# EAGLE schematic leto_ppm (EAGLE 9.1.2)

## Sheet 1 of 2
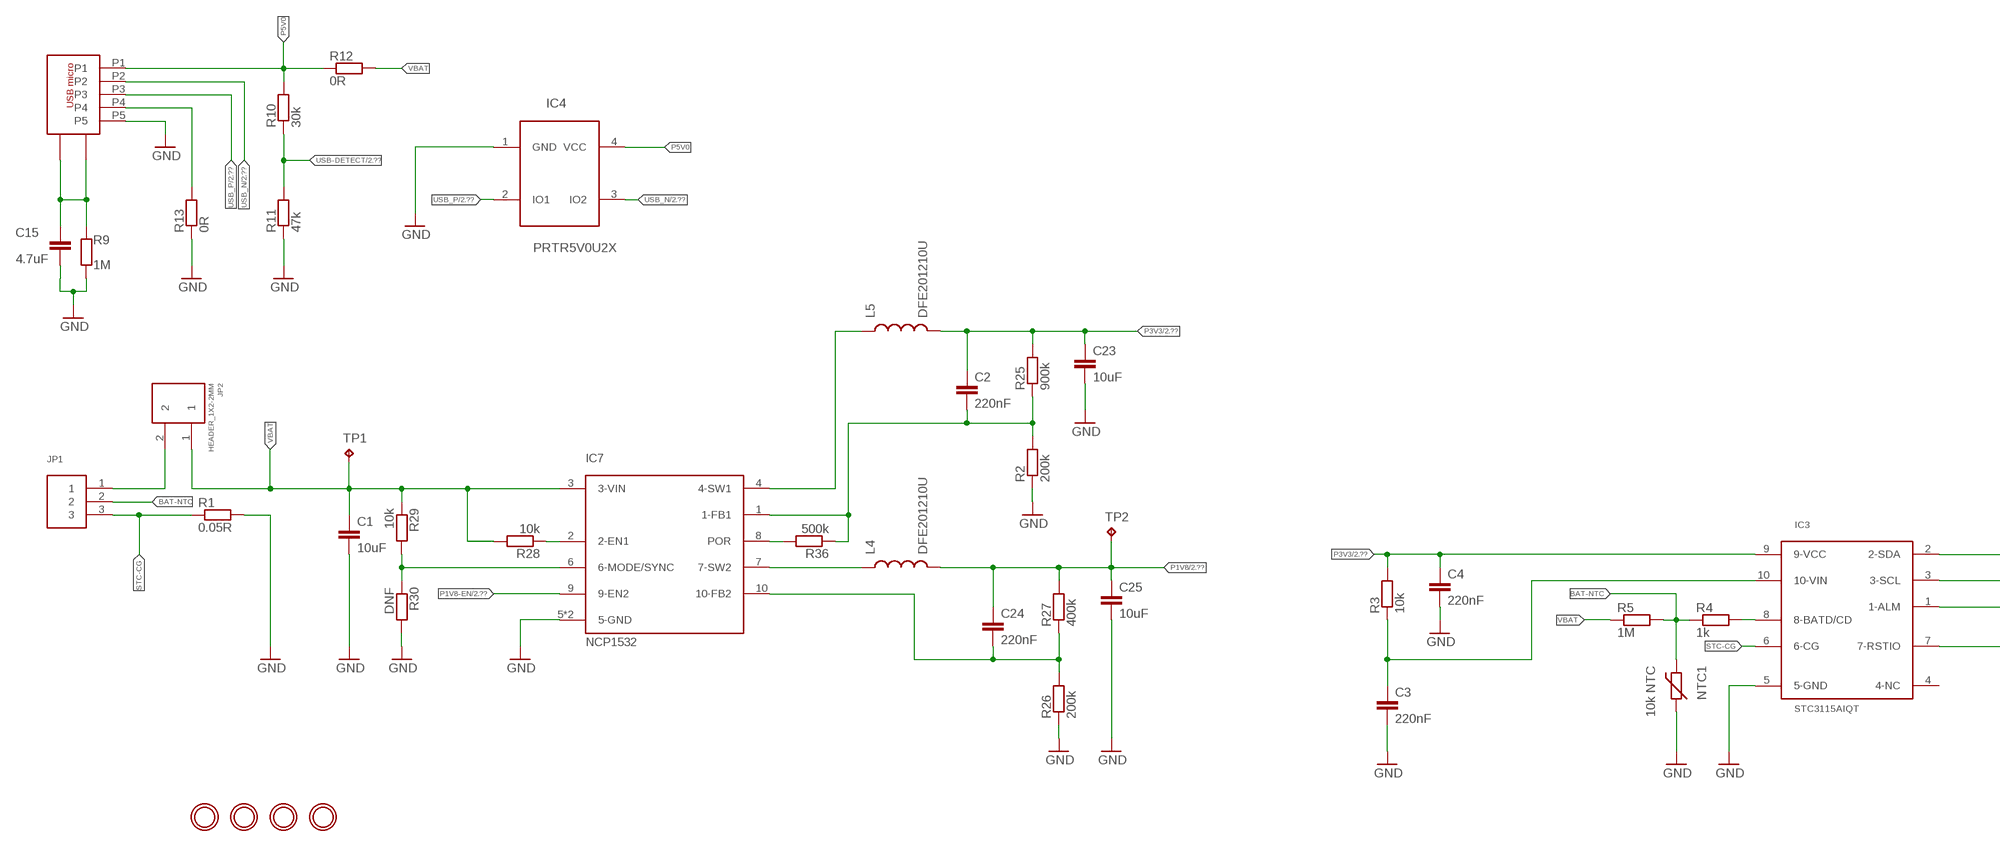
[diagram p0: schematic, sheet 1, part 1 of 2]
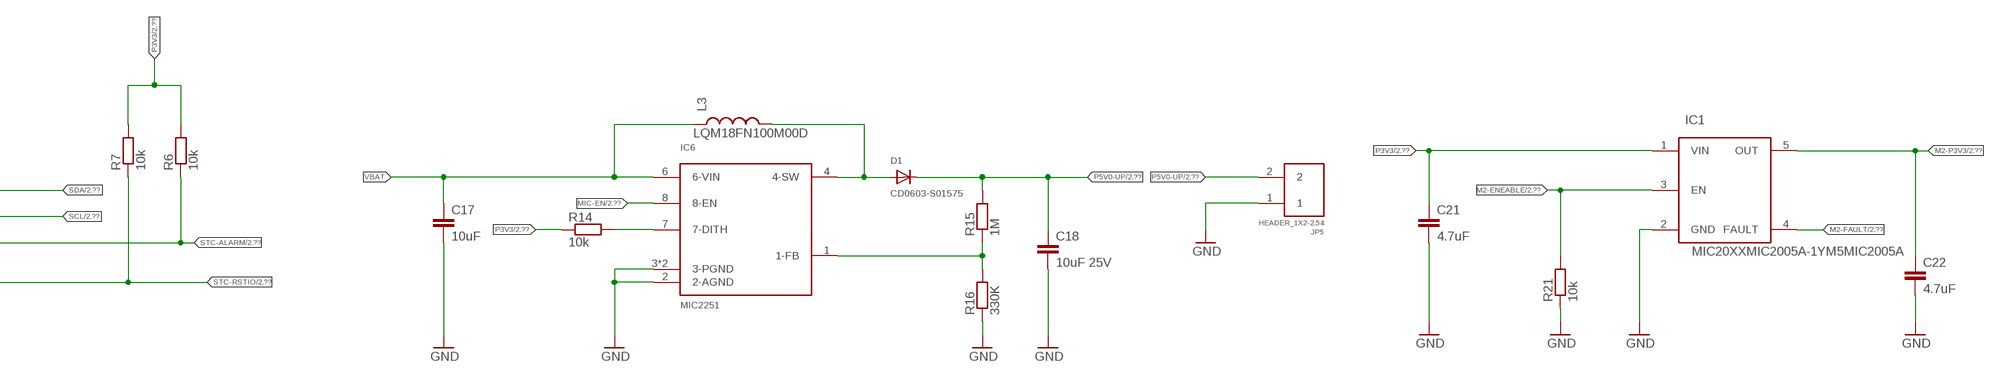
[diagram p1: schematic, sheet 1, part 2 of 2]

### Parts
C1  10uF  C-EUC0603  [C0603]
C2  220nF  C-EUC0402-SMALL  [C0402-SMALL]
C3  220nF  C-EUC0402-SMALL  [C0402-SMALL]
C4  220nF  C-EUC0402-SMALL  [C0402-SMALL]
C15  4.7uF  C-EUC0402-SMALL  [C0402-SMALL]
C17  10uF  C-EUC0603  [C0603]
C18  10uF 25V  C-EUC0603  [C0603]
C21  4.7uF  C-EUC0402-SMALL  [C0402-SMALL]
C22  4.7uF  C-EUC0402-SMALL  [C0402-SMALL]
C23  10uF  C-EUC0603  [C0603]
C24  220nF  C-EUC0402-SMALL  [C0402-SMALL]
C25  10uF  C-EUC0603  [C0603]
D1  CD0603-S01575  DIODE  [0603-DIODE]
IC1  MIC20XXMIC2005A-1YM5MIC2005A  [SOT23-5]
IC3  STC3115AIQT  [DFN10_2X3MM]
IC4  PRTR5V0U2X  [SOT143]
IC6  MIC2251  [MLF-8-2X2]
IC7  NCP1532  [UDNF10-3X3]
JP1  HEADER_1X32.54MM  [1X3-2.54MM]
JP2  HEADER_1X2-2MM  [1X2_2MM]
JP5  HEADER_1X2-2.54  [1X2-2.54MM]
L3  LQM18FN100M00D  INDUCTOR0603  [0603]
L4  DFE201210U  INDUCTOR0805  [0805]
L5  DFE201210U  INDUCTOR0805  [0805]
MD1  MOUNTINGHOLE2.5  [MOUNTINGHOLE_2.5_PLATED]
MD2  MOUNTINGHOLE2.5  [MOUNTINGHOLE_2.5_PLATED]
MD3  MOUNTINGHOLE2.5  [MOUNTINGHOLE_2.5_PLATED]
MD4  MOUNTINGHOLE2.5  [MOUNTINGHOLE_2.5_PLATED]
NTC1  10k NTC  RESISTOR-NTC0402  [C0402-SMALL]
R1  0.05R  RESISTOR0603-RES  [0603-RES]
R2  200k  RESISTORC0402-SMALL  [C0402-SMALL]
R3  10k  RESISTORC0402-SMALL  [C0402-SMALL]
R4  1k  RESISTORC0402-SMALL  [C0402-SMALL]
R5  1M  RESISTORC0402-SMALL  [C0402-SMALL]
R6  10k  RESISTORC0402-SMALL  [C0402-SMALL]
R7  10k  RESISTORC0402-SMALL  [C0402-SMALL]
R9  1M  RESISTORC0402-SMALL  [C0402-SMALL]
R10  30k  RESISTORC0402-SMALL  [C0402-SMALL]
R11  47k  RESISTORC0402-SMALL  [C0402-SMALL]
R12  0R  RESISTORC0402-SMALL  [C0402-SMALL]
R13  0R  RESISTORC0402-SMALL  [C0402-SMALL]
R14  10k  RESISTORC0402-SMALL  [C0402-SMALL]
R15  1M  RESISTORC0402-SMALL  [C0402-SMALL]
R16  330K  RESISTORC0402-SMALL  [C0402-SMALL]
R21  10k  RESISTORC0402-SMALL  [C0402-SMALL]
R25  900k  RESISTORC0402-SMALL  [C0402-SMALL]
R26  200k  RESISTORC0402-SMALL  [C0402-SMALL]
R27  400k  RESISTORC0402-SMALL  [C0402-SMALL]
R28  10k  RESISTORC0402-SMALL  [C0402-SMALL]
R29  10k  RESISTORC0402-SMALL  [C0402-SMALL]
R30  DNF  RESISTORC0402-SMALL  [C0402-SMALL]
R36  500k  RESISTORC0402-SMALL  [C0402-SMALL]
TP1  TPTP20R  [TP20R]
TP2  TPTP11R  [TP11R]
USB1  USB3140-30  [USB3140-30-0230]

### Nets
BAT-NTC: JP1.2 NTC1.1 R4.1 R5.2
GND: C1.2 C3.2 C4.2 C15.2 C17.2 C18.2 C21.2 C22.2 C23.2 C25.2 IC1.2(GND) IC3.5(5-GND) IC4.1(GND) IC6.2(2-AGND) IC6.3(3-PGND) IC6.EP(3-PGND) IC7.5(5-GND) IC7.P$11(5-GND) JP5.1 NTC1.2 R1.2 R2.1 R9.1 R11.1 R13.1 R16.1 R21.1 R26.1 R30.2 USB1.P5 ; also sheet 2
M2-ENEABLE: IC1.3(EN) R21.2 ; also sheet 2
M2-FAULT: IC1.4(FAULT) ; also sheet 2
M2-P3V3: C22.1 IC1.5(OUT) ; also sheet 2
MIC-EN: IC6.8(8-EN) ; also sheet 2
N$1: JP1.1 JP2.2
N$3: IC7.4(4-SW1) L5.1
N$4: C3.1 IC3.10(10-VIN) R3.1
N$5: IC3.8(8-BATD/CD) R4.2
N$11: IC7.8(POR) R36.2
N$12: R13.2 USB1.P4
N$13: IC6.7(7-DITH) R14.2
N$14: C2.2 IC7.1(1-FB1) R2.2 R25.1 R36.1
N$15: D1.A IC6.4(4-SW) L3.2
N$16: C24.2 IC7.10(10-FB2) R26.2 R27.1
N$17: IC6.1(1-FB) R15.1 R16.2
N$18: IC7.7(7-SW2) L4.1
N$21: IC7.2(2-EN1) R28.1
N$23: IC7.6(6-MODE/SYNC) R29.2 R30.1
P1V8: C24.1 C25.1 L4.2 R27.2 TP2.TP ; also sheet 2
P1V8-EN: IC7.9(9-EN2) ; also sheet 2
P3V3: C2.1 C4.1 C21.1 C23.1 IC1.1(VIN) IC3.9(9-VCC) L5.2 R3.2 R6.2 R7.2 R14.1 R25.2 ; also sheet 2
P5V0: IC4.4(VCC) R10.2 R12.1 USB1.P1
P5V0-UP: C18.1 D1.K(C) JP5.2 R15.2 ; also sheet 2
SCL: IC3.3(3-SCL) ; also sheet 2
SDA: IC3.2(2-SDA) ; also sheet 2
STC-ALARM: IC3.1(1-ALM) R6.1 ; also sheet 2
STC-CG: IC3.6(6-CG) JP1.3 R1.1
STC-RSTIO: IC3.7(7-RSTIO) R7.1 ; also sheet 2
USB-DETECT: R10.1 R11.2 ; also sheet 2
USB-GND: C15.1 R9.2 USB1.GND1 USB1.GND2
USB_N: IC4.3(IO2) USB1.P2 ; also sheet 2
USB_P: IC4.2(IO1) USB1.P3 ; also sheet 2
VBAT: C1.1 C17.1 IC6.6(6-VIN) IC7.3(3-VIN) JP2.1 L3.1 R5.1 R12.2 R28.2 R29.1 TP1.TP
Unconnected: IC3.4(4-NC)

## Sheet 2 of 2
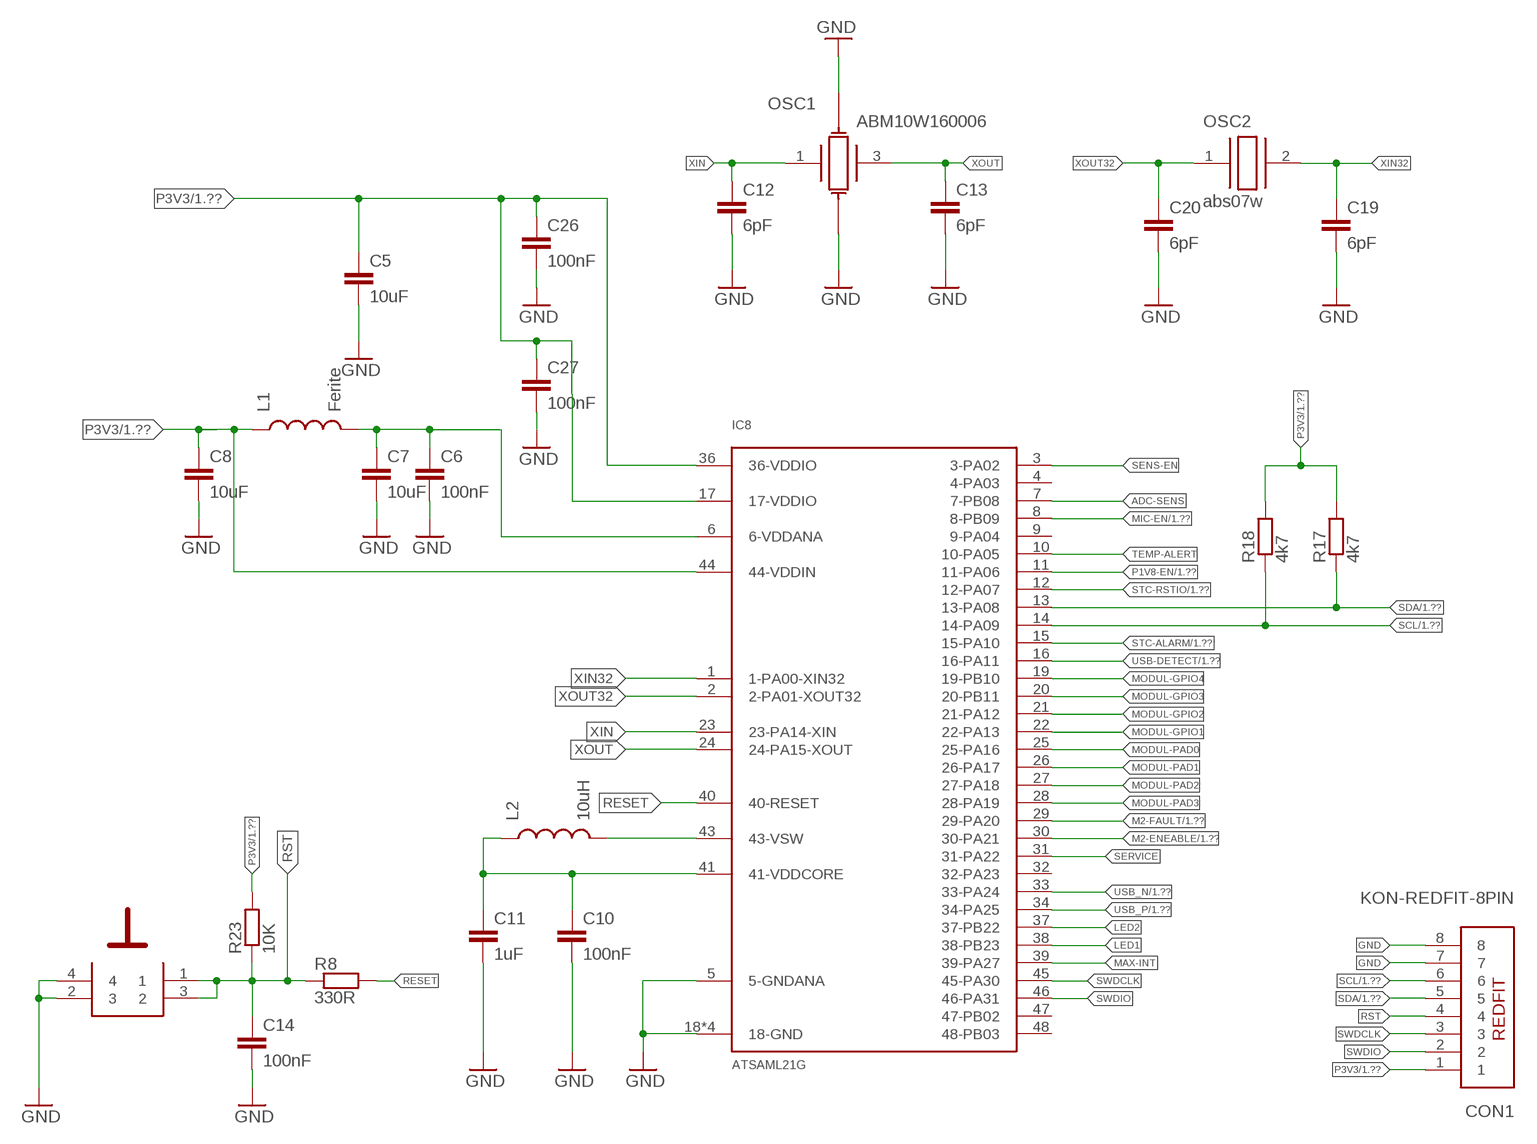
[diagram p2: schematic, sheet 2, part 1 of 2]
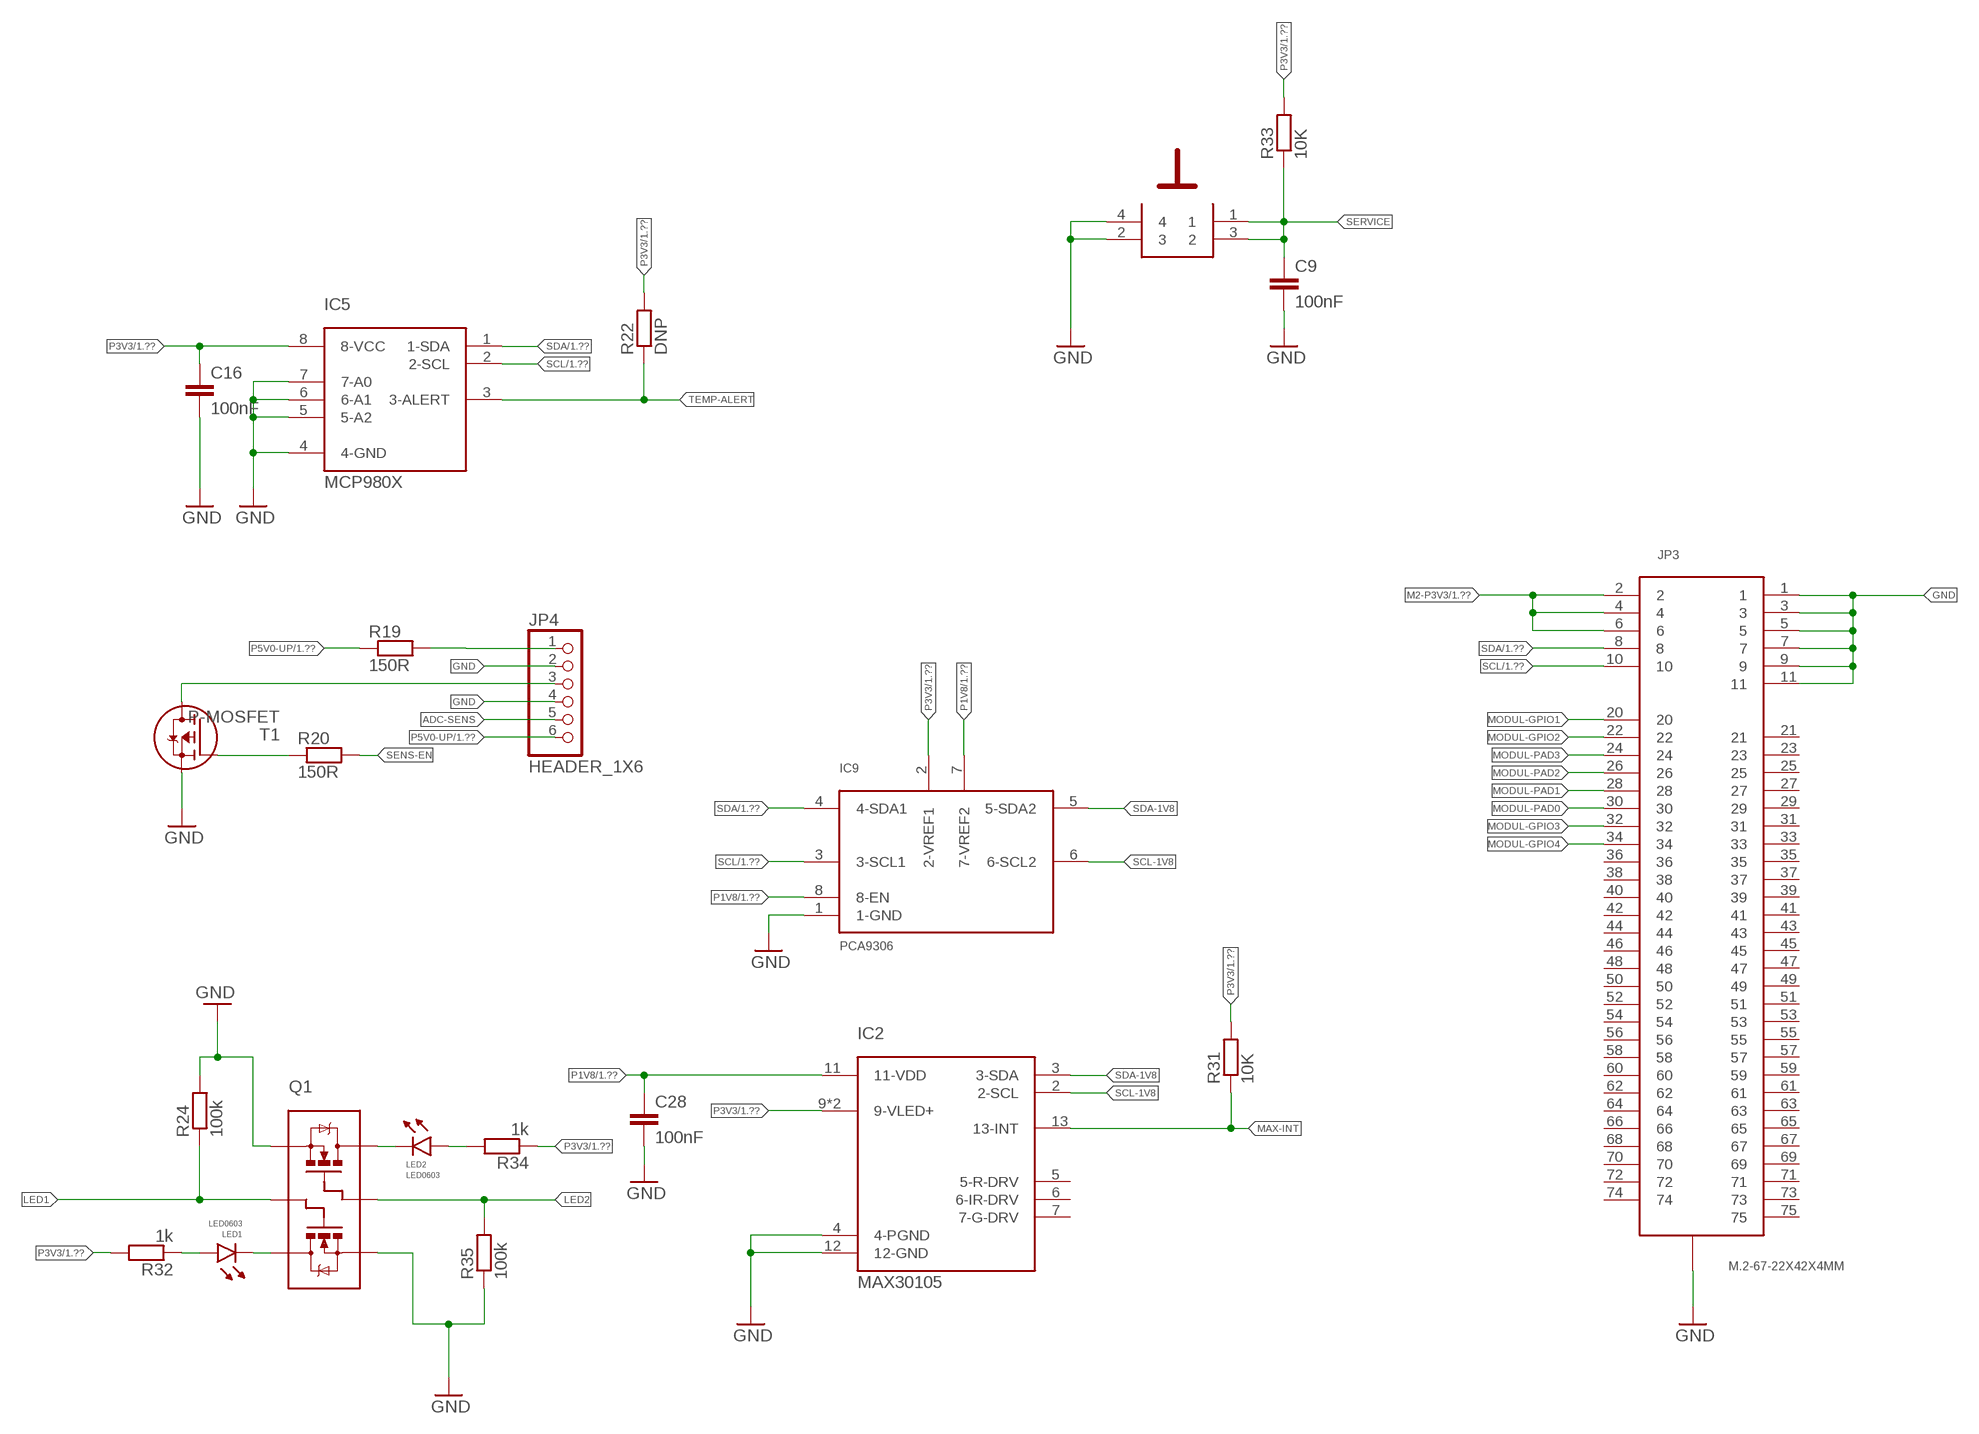
[diagram p3: schematic, sheet 2, part 2 of 2]

### Parts
C5  10uF  C-EUC0603  [C0603]
C6  100nF  C-EUC0402-SMALL  [C0402-SMALL]
C7  10uF  C-EUC0603  [C0603]
C8  10uF  C-EUC0603  [C0603]
C9  100nF  C-EUC0402-SMALL  [C0402-SMALL]
C10  100nF  C-EUC0402-SMALL  [C0402-SMALL]
C11  1uF  C-EUC0402-SMALL  [C0402-SMALL]
C12  6pF  C-EUC0402-SMALL  [C0402-SMALL]
C13  6pF  C-EUC0402-SMALL  [C0402-SMALL]
C14  100nF  C-EUC0402-SMALL  [C0402-SMALL]
C16  100nF  C-EUC0402-SMALL  [C0402-SMALL]
C19  6pF  C-EUC0402-SMALL  [C0402-SMALL]
C20  6pF  C-EUC0402-SMALL  [C0402-SMALL]
C26  100nF  C-EUC0402-SMALL  [C0402-SMALL]
C27  100nF  C-EUC0402-SMALL  [C0402-SMALL]
C28  100nF  C-EUC0402-SMALL  [C0402-SMALL]
CON1  KON-REDFIT-8PIN  [KON-REDFIT-8PIN]
IC2  MAX30105  [14-OESIP]
IC5  MCP980X  [DNF82X3MM]
IC8  ATSAML21G  [QFN48]
IC9  PCA9306  [SO8]
JP3  M.2-67-22X42X4MM  [M2-67POS-0.5MM]
JP4  HEADER_1X6  [1X6_2.54]
L1  Ferite  INDUCTOR0603  [0603]
L2  10uH  INDUCTOR0603  [0603]
LED1  LED0603  [0603-DIODE]
LED2  LED0603  [0603-DIODE]
OSC1  ABM10W160006  CRYSTAL-GNDABM10W  [ABM10W]
OSC2  abs07w  CRYSTAL  [ABS07W]
Q1  MOSFET-N-X2-SOT363  [SOT363]
R8  330R  RESISTORC0402-SMALL  [C0402-SMALL]
R17  4k7  RESISTORC0402-SMALL  [C0402-SMALL]
R18  4k7  RESISTORC0402-SMALL  [C0402-SMALL]
R19  150R  RESISTORC0402-SMALL  [C0402-SMALL]
R20  150R  RESISTORC0402-SMALL  [C0402-SMALL]
R22  DNP  RESISTORC0402-SMALL  [C0402-SMALL]
R23  10K  RESISTORC0402-SMALL  [C0402-SMALL]
R24  100k  RESISTORC0402-SMALL  [C0402-SMALL]
R31  10K  RESISTORC0402-SMALL  [C0402-SMALL]
R32  1k  RESISTORC0402-SMALL  [C0402-SMALL]
R33  10K  RESISTORC0402-SMALL  [C0402-SMALL]
R34  1k  RESISTORC0402-SMALL  [C0402-SMALL]
R35  100k  RESISTORC0402-SMALL  [C0402-SMALL]
RESET  TACTB  [TACTB-64K-F]
SERVICE  TACTB  [TACTB-64K-F]
T1  P-MOSFET  [SOT23-R]

### Nets
ADC-SENS: IC8.7(7-PB08) JP4.5
GND: C5.2 C6.2 C7.2 C8.2 C9.2 C10.2 C11.2 C12.2 C13.2 C14.2 C16.2 C19.2 C20.2 C26.2 C27.2 C28.2 CON1.7 CON1.8 IC2.4(4-PGND) IC2.12(12-GND) IC5.4(4-GND) IC5.5(5-A2) IC5.6(6-A1) IC5.7(7-A0) IC8.5(5-GNDANA) IC8.18(18-GND) IC8.35(18-GND) IC8.42(18-GND) IC8.EP(18-GND) IC9.1(1-GND) JP3.1 JP3.3 JP3.5 JP3.7 JP3.9 JP3.11 JP3.GND_SCRW(SCREW) JP4.2 JP4.4 OSC1.2(1GND) OSC1.4(GND) Q1.1(S2) Q1.4(S1) R24.2 R35.1 RESET.2 RESET.4 SERVICE.2 SERVICE.4 T1.2(S) ; also sheet 1
LED1: IC8.38(38-PB23) Q1.2(G2) R24.1
LED2: IC8.37(37-PB22) Q1.5(G1) R35.2
M2-ENEABLE: IC8.30(30-PA21) ; also sheet 1
M2-FAULT: IC8.29(29-PA20) ; also sheet 1
M2-P3V3: JP3.2 JP3.4 JP3.6 ; also sheet 1
MAX-INT: IC2.13(13-INT) IC8.39(39-PA27) R31.1
MIC-EN: IC8.8(8-PB09) ; also sheet 1
MODUL-GPIO1: IC8.22(22-PA13) JP3.20
MODUL-GPIO2: IC8.21(21-PA12) JP3.22
MODUL-GPIO3: IC8.20(20-PB11) JP3.32
MODUL-GPIO4: IC8.19(19-PB10) JP3.34
MODUL-PAD0: IC8.25(25-PA16) JP3.30
MODUL-PAD1: IC8.26(26-PA17) JP3.28
MODUL-PAD2: IC8.27(27-PA18) JP3.26
MODUL-PAD3: IC8.28(28-PA19) JP3.24
N$2: LED1.A R32.1
N$6: C10.1 C11.1 IC8.41(41-VDDCORE) L2.1
N$7: LED1.K Q1.3(D1)
N$8: IC8.43(43-VSW) L2.2
N$9: JP4.1 R19.2
N$19: R20.1 T1.1(G)
N$20: JP4.3 T1.3(D)
N$22: C6.1 C7.1 IC8.6(6-VDDANA) L1.2
N$29: LED2.K Q1.6(D2)
N$30: LED2.A R34.2
P1V8: C28.1 IC2.11(11-VDD) IC9.7(7-VREF2) IC9.8(8-EN) ; also sheet 1
P1V8-EN: IC8.11(11-PA06) ; also sheet 1
P3V3: C5.1 C8.1 C16.1 C26.1 C27.1 CON1.1 IC2.9(9-VLED+) IC2.10(9-VLED+) IC5.8(8-VCC) IC8.17(17-VDDIO) IC8.36(36-VDDIO) IC8.44(44-VDDIN) IC9.2(2-VREF1) L1.1 R17.2 R18.2 R22.2 R23.2 R31.2 R32.2 R33.2 R34.1 ; also sheet 1
P5V0-UP: JP4.6 R19.1 ; also sheet 1
RESET: IC8.40(40-RESET) R8.2
RST: C14.1 CON1.4 R8.1 R23.1 RESET.1 RESET.3
SCL: CON1.6 IC5.2(2-SCL) IC8.14(14-PA09) IC9.3(3-SCL1) JP3.10 R18.1 ; also sheet 1
SCL-1V8: IC2.2(2-SCL) IC9.6(6-SCL2)
SDA: CON1.5 IC5.1(1-SDA) IC8.13(13-PA08) IC9.4(4-SDA1) JP3.8 R17.1 ; also sheet 1
SDA-1V8: IC2.3(3-SDA) IC9.5(5-SDA2)
SENS-EN: IC8.3(3-PA02) R20.2
SERVICE: C9.1 IC8.31(31-PA22) R33.1 SERVICE.1 SERVICE.3
STC-ALARM: IC8.15(15-PA10) ; also sheet 1
STC-RSTIO: IC8.12(12-PA07) ; also sheet 1
SWDCLK: CON1.3 IC8.45(45-PA30)
SWDIO: CON1.2 IC8.46(46-PA31)
TEMP-ALERT: IC5.3(3-ALERT) IC8.10(10-PA05) R22.1
USB-DETECT: IC8.16(16-PA11) ; also sheet 1
USB_N: IC8.33(33-PA24) ; also sheet 1
USB_P: IC8.34(34-PA25) ; also sheet 1
XIN: C12.1 IC8.23(23-PA14-XIN) OSC1.1
XIN32: C19.1 IC8.1(1-PA00-XIN32) OSC2.2
XOUT: C13.1 IC8.24(24-PA15-XOUT) OSC1.3
XOUT32: C20.1 IC8.2(2-PA01-XOUT32) OSC2.1
Unconnected: IC2.5(5-R-DRV) IC2.6(6-IR-DRV) IC2.7(7-G-DRV) IC8.4(4-PA03) IC8.9(9-PA04) IC8.32(32-PA23) IC8.47(47-PB02) IC8.48(48-PB03) JP3.21 JP3.23 JP3.25 JP3.27 JP3.29 JP3.31 JP3.33 JP3.35 JP3.36 JP3.37 JP3.38 JP3.39 JP3.40 JP3.41 JP3.42 JP3.43 JP3.44 JP3.45 JP3.46 JP3.47 JP3.48 JP3.49 JP3.50 JP3.51 JP3.52 JP3.53 JP3.54 JP3.55 JP3.56 JP3.57 JP3.58 JP3.59 JP3.60 JP3.61 JP3.62 JP3.63 JP3.64 JP3.65 JP3.66 JP3.67 JP3.68 JP3.69 JP3.70 JP3.71 JP3.72 JP3.73 JP3.74 JP3.75

## Library data of the parts
C1-C28 = knihovna:C-EU: CAPACITOR, European symbol
CON1 = knihovna:KON-REDFIT-8PIN
D1 = knihovna:DIODE: Diode SMA Model Volts Amps Type Vf Vr Digikey # Notes SSA34-E3 40V 3A Schottky 480mV @ 3A 200uA @ 40V SSA34-E3/61TGITR-ND CDBA120-G 20V 1A Schottky 500mV @ 1A 500uA @ 20V 641-1014-6-ND REEL MBRA210 10V 2A Schottky 350mV @ 2A 700uA @ 10V MBRA210LT3 SOD-123 Model Volts Amps Type Vf Vr Order # Notes BAT54T1G 30V 200mA Schottky 800mV @ 200mA 2uA @ 25V BAT54T1GOSTR-ND B0530W 30V 500mA Schottky 430mV @ 500mA 130uA @ 30V B0530W-FDICT-ND REEL MBR120 1A 20V Schottky 340mV @ 1A MBR120VLSFT1GOSCT-ND SOD-323 Model Volts Amps Type Vf Vr Order # Notes PMEG2005EJ 20V 500mA Schottky 355mV @ 500mA 568-4110-1-ND ZLLS410 10V 570mA Schottky 380mV @ 570mA ZLLS410CT-ND 1N4148WS 75V 150mA Silicon/Simple 1V 1N4148WSFSCT-ND REEL SOD-523 Model Volts Amps Type Vf Vr Order # Notes BAT54XV2 30V 200mA Schottky 0.8V @ 100mA BAT54XV2CT-ND TB751S 30V 30mA Schottky RB751S-40TE61CT-ND SOT23-R/W (R = Solder Paste/Reflow Ovens, W = Hand-Soldering) Model Volts Amps Type Vf Vr Order # Notes BAT54FILM 40V 300mA Schottky 497-7162-1-ND
IC1 = knihovna:MIC20XX: MIC20XX family of switches are current limiting, high-side power switches, designed for general purpose power distribution and control in digital televisions (DTV), printers, set top boxes (STB), PCs, PDAs, and other peripheral devices (see Functionality Table and Pin Configuration drawings).; CURRENT: 0.5A; ENABLE: Active high; MARKING: FA51
IC2 = knihovna:MAX30105: The MAX30105 is an integrated particle-sensing module. It includes internal LEDs, photodetectors, optical elements, and low-noise electronics with ambient light rejection. The MAX30105 provides a complete system solution to ease the design-in process of smoke detection applications including fire alarms. Due to its extremely small size, the MAX30105 can also be used as a smoke detection sensor for mobile and wearable devices. The MAX30105 operates on a single 1.8V power supply and a separate 5.0V power supply for the internal LEDs. It communicates through a standard I2C-compatible interface. The module can be shut down through software with zero standby current, allowing the power rails to remain powered at all times.
IC3 = knihovna:STC3115: The STC3115 includes the hardware functions required to implement a low-cost gas gauge for battery monitoring. The STC3115 uses current sensing, Coulomb counting and accurate measurements of the battery voltage to estimate the state-of-charge (SOC) of the battery. An internal temperature sensor simplifies implementation of temperature compensation. An alarm output signals a low SOC condition and can also indicate low battery voltage. The alarm threshold levels are programmable. The STC3115 offers advanced features to ensure high performance gas gauging in all application conditions.
IC4 = knihovna:PRTR5V0U2X
IC5 = knihovna:MCP980X: Description Microchip Technology Inc.’s MCP9808 digital temperature sensor converts temperatures between -20°C and +100°C to a digital word with ±0.25°C/±0.5°C (typical/maximum) accuracy. The MCP9808 comes with user-programmable registers that provide flexibility for temperature sensing applications. The registers allow user-selectable settings such as Shutdown or Low-Power modes and the specification of temperature Alert window limits and critical output limits. When the temperature changes beyond the specified boundary limits, the MCP9808 outputs an Alert signal. The user has the option of setting the Alert output signal polarity as an active-low or activehigh comparator output for thermostat operation, or as a temperature Alert interrupt output for microprocessorbased systems. The Alert output can also be configured as a critical temperature output only. This sensor has an industry standard 400 kHz, 2-wire, SMBus/I2C compatible serial interface, allowing up to eight or sixteen sensors to be controlled with a single serial bus (see Table 3-2 for available Address codes). These features make the MCP9808 ideal for sophisticated, multi-zone, temperature-monitoring applications.
IC6 = knihovna:MIC2251
IC7 = knihovna:NCP1532: The NCP1532 dual step down DCDC converter is a monolithic integrated circuit dedicated to supply core and I/O voltages of new multimedia design in portable applications powered from 1−cell Li−ion or 3 cell Alkaline / NiCd / NiMH batteries. Both channels are externally adjustable from 0.9 V to 3.3 V and can source totally up to 1.6 A, 1.0 A maximum per channel. Converters are running at 2.25 MHz switching frequency which reduces component size by allowing the use of small inductor (down to 1 H) and capacitors and operates 180° out of phase to reduce large amount of current demand on the battery. Automatic switching PWM/PFM mode and synchronous rectification offer improved system efficiency. The device can also operate into fixed frequency PWM mode for low noise applications where low ripple and good load transients are required. Additional features include integrated soft−start, cycle−by−cycle current limit and thermal shutdown protection. The device can also be synchronized to an external clock signal in the range of 2.25 MHz. The NCP1532 is available in a space saving, ultra low profile 3x3 x 0.55 mm 10 pin DFN package.
IC8 = knihovna:ATSAML21G: Atmel® | SMART SAM L21 is a series of Ultra low-power microcontrollers using the 32-bit ARM® Cortex® -M0+ processor at max. 48MHz (2.46 CoreMark® /MHz) and up to 256KB Flash and 40KB of SRAM in a 32, 48, and 64 pin package. The sophisticated power management technologies, such as power domain gating, SleepWalking, Ultra low-power peripherals and more, allow for very low current consumptions. The highly configurable peripherals include a touch controller supporting capacitive interfaces with proximity sensing.
IC9 = knihovna:PCA9306: The PCA9306 is a dual bidirectional I2C-bus and SMBus voltage-level translator with an enable (EN) input, and is operational from 1.0 V to 3.6 V (Vref(1)) and 1.8 V to 5.5 V
JP1 = knihovna:HEADER_1X3
JP2 JP5 = knihovna:HEADER_1X2
JP3 = knihovna:M.2-67
JP4 = knihovna:HEADER_1X6
L1-L5 = knihovna:INDUCTOR: Inductors Basic Inductor/Choke - 0603 and 1206. Footprints are not proven and vary greatly between part numbers. INDUCTOR POWER 3.3UH 4.0A SMD 0.197" L x 0.197" W x 0.177" H (5.00mm x 5.00mm x 4.50mm)
LED1 LED2 = knihovna:LED
MD1-MD4 = knihovna:MOUNTINGHOLE: Mounting Hole For #2 screws (0.086"/2.18mm width, 0.094"/2.4mm hole) use 2.5mm
NTC1 = knihovna:RESISTOR-NTC
OSC1 = knihovna:CRYSTAL-GND
OSC2 = knihovna:CRYSTAL
Q1 = knihovna:MOSFET-N-X2
R1-R36 = knihovna:RESISTOR: Resistor Basic schematic elements and footprints for 0603, 1206, and PTH resistors.
RESET SERVICE = knihovna:TACTB
T1 = knihovna:P-MOSFET: These P-Channel MOSFETs from International Rectifier utilize advanced processing techniques to achieve extremely low on-resistance per silicon area. This benefit, combined with the fast switching speed and ruggedized device design that HEXFET® power MOSFETs are well known for, provides the designer with an extremely efficient and reliable device for use in battery and load management.
TP1 = knihovna:TP: Test pad
TP2 = testpad:TP: Test pad
USB1 = knihovna:USB3140-30